# Altium project Main_circuit.PrjPcb
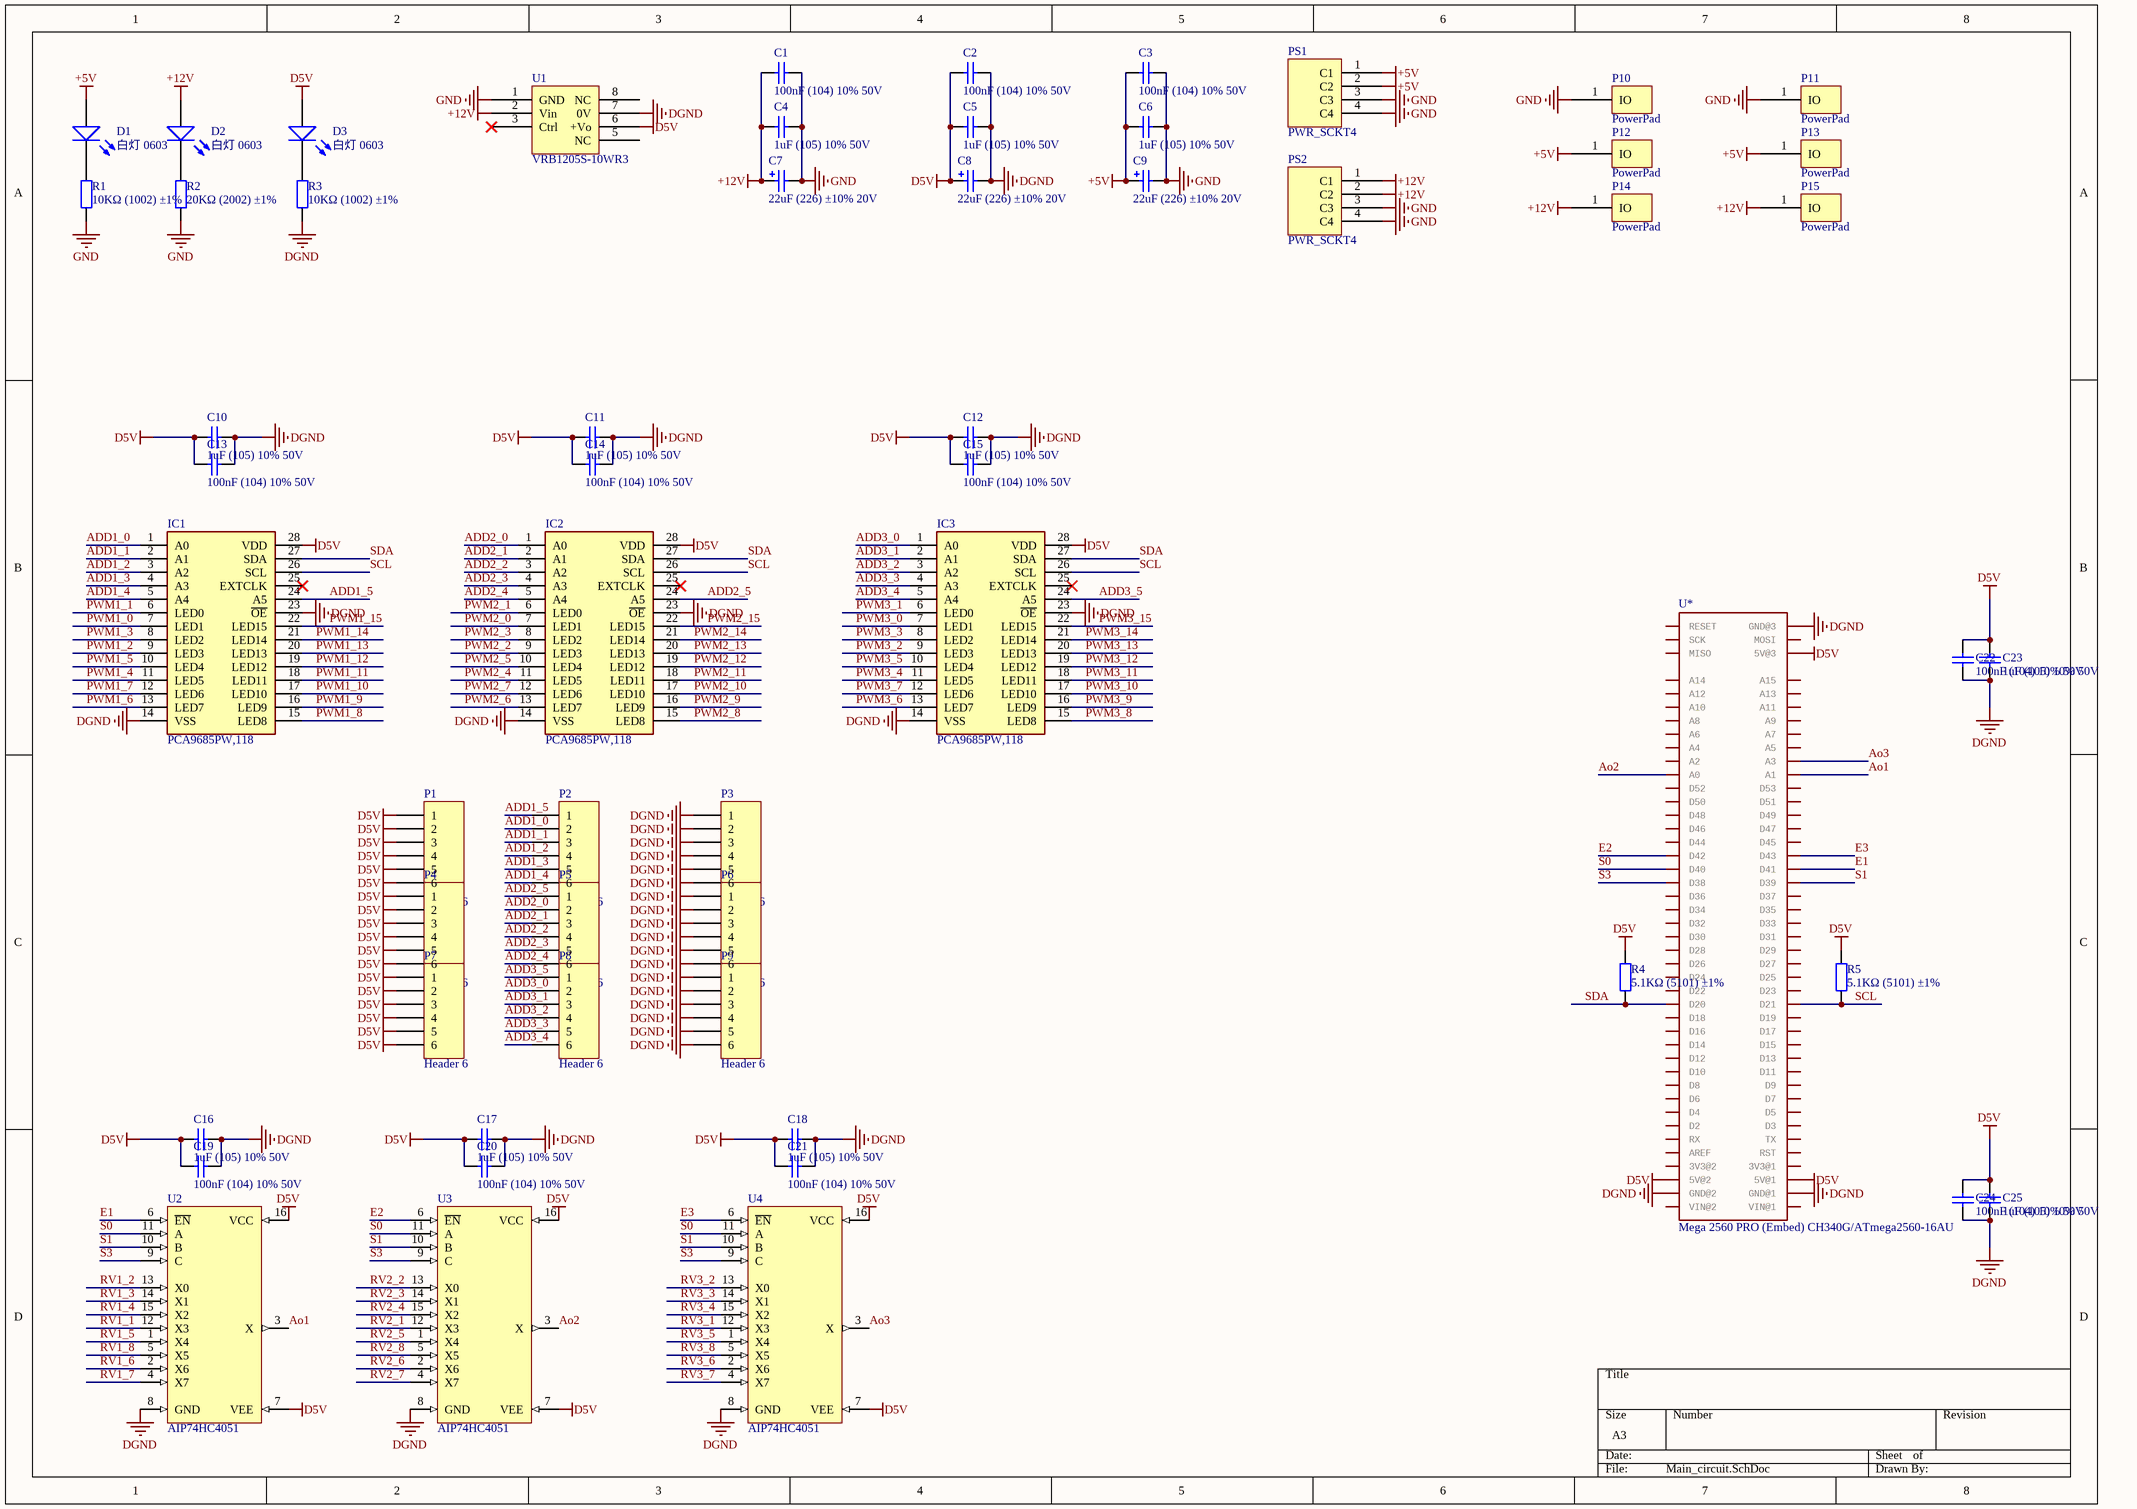
[diagram p0: Main_circuit.SchDoc]
2 sheets, 82 parts. Net scope: global (net labels, ports and power ports of the same name join across sheets).
Board file: MainCircuit.PcbDoc
Sheets:
  Main_circuit.SchDoc
  SS_24.SchDoc

## Sheet Main_circuit.SchDoc
size A3

### Parts
C1  100nF (104) 10% 50V  [LC-0603_C]
C2  100nF (104) 10% 50V  [LC-0603_C]
C3  100nF (104) 10% 50V  [LC-0603_C]
C4  1uF (105) 10% 50V  [LC-0603_C]
C5  1uF (105) 10% 50V  [LC-0603_C]
C6  1uF (105) 10% 50V  [LC-0603_C]
C7  22uF (226) ±10% 20V  [LC-CASE-B_3528]
C8  22uF (226) ±10% 20V  [LC-CASE-B_3528]
C9  22uF (226) ±10% 20V  [LC-CASE-B_3528]
C10  1uF (105) 10% 50V  [LC-0603_C]
C11  1uF (105) 10% 50V  [LC-0603_C]
C12  1uF (105) 10% 50V  [LC-0603_C]
C13  100nF (104) 10% 50V  [LC-0603_C]
C14  100nF (104) 10% 50V  [LC-0603_C]
C15  100nF (104) 10% 50V  [LC-0603_C]
C16  1uF (105) 10% 50V  [LC-0603_C]
C17  1uF (105) 10% 50V  [LC-0603_C]
C18  1uF (105) 10% 50V  [LC-0603_C]
C19  100nF (104) 10% 50V  [LC-0603_C]
C20  100nF (104) 10% 50V  [LC-0603_C]
C21  100nF (104) 10% 50V  [LC-0603_C]
C22  100nF (104) 10% 50V  [LC-0603_C]
C23  1uF (105) 10% 50V  [LC-0603_C]
C24  100nF (104) 10% 50V  [LC-0603_C]
C25  1uF (105) 10% 50V  [LC-0603_C]
D1  白灯 0603  [LC-0603_LED_S1]
D2  白灯 0603  [LC-0603_LED_S1]
D3  白灯 0603  [LC-0603_LED_S1]
IC1  PCA9685PW,118  [LC-TSSOP-28]
IC2  PCA9685PW,118  [LC-TSSOP-28]
IC3  PCA9685PW,118  [LC-TSSOP-28]
P1  Header 6  [HDR1X6]
P2  Header 6  [HDR1X6]
P3  Header 6  [HDR1X6]
P4  Header 6  [HDR1X6]
P5  Header 6  [HDR1X6]
P6  Header 6  [HDR1X6]
P7  Header 6  [HDR1X6]
P8  Header 6  [HDR1X6]
P9  Header 6  [HDR1X6]
P10  PowerPad  [PowerPad]
P11  PowerPad  [PowerPad]
P12  PowerPad  [PowerPad]
P13  PowerPad  [PowerPad]
P14  PowerPad  [PowerPad]
P15  PowerPad  [PowerPad]
PS1  PWR_SCKT4  [PWR_SCKT_4P3.81]
PS2  PWR_SCKT4  [PWR_SCKT_4P3.81]
R1  10KΩ (1002) ±1%  [LC-0603_R]
R2  20KΩ (2002) ±1%  [LC-0603_R]
R3  10KΩ (1002) ±1%  [LC-0603_R]
R4  5.1KΩ (5101) ±1%  [LC-0603_R]
R5  5.1KΩ (5101) ±1%  [LC-0603_R]
U1  VRB1205S-10WR3  [VRB1205S-10WR3]
U2  AIP74HC4051  [LC-SOP-16_150mil]
U3  AIP74HC4051  [LC-SOP-16_150mil]
U4  AIP74HC4051  [LC-SOP-16_150mil]
U*  Mega 2560 PRO (Embed) CH340G/ATmega2560-16AU  [Mega 2560 PRO (Embed)]

### Nets
+5V: C3.2 C6.2 C9.1 D1.A P12.1(IO) P13.1(IO) PS1.1(C1) PS1.2(C2)
+12V: C1.2 C4.2 C7.1 D2.A P14.1(IO) P15.1(IO) PS2.1(C1) PS2.2(C2) U1.2(Vin)
D5V: C2.2 C5.2 C8.1 C10.1 C11.1 C12.1 C13.1 C14.1 C15.1 C16.1 C17.1 C18.1 C19.1 C20.1 C21.1 C22.1 C23.1 C24.1 C25.1 D3.A IC1.28(VDD) IC2.28(VDD) IC3.28(VDD) P1.1 P1.2 P1.3 P1.4 P1.5 P1.6 P4.1 P4.2 P4.3 P4.4 P4.5 P4.6 P7.1 P7.2 P7.3 P7.4 P7.5 P7.6 R4.2 R5.2 U1.6(+Vo) U2.7(VEE) U2.16(VCC) U3.7(VEE) U3.16(VCC) U4.7(VEE) U4.16(VCC) U*.5V@1 U*.5V@2 U*.5V@3
DGND: C2.1 C5.1 C8.2 C10.2 C11.2 C12.2 C13.2 C14.2 C15.2 C16.2 C17.2 C18.2 C19.2 C20.2 C21.2 C22.2 C23.2 C24.2 C25.2 IC1.14(VSS) IC1.23(~{OE}) IC2.14(VSS) IC2.23(~{OE}) IC3.14(VSS) IC3.23(~{OE}) P3.1 P3.2 P3.3 P3.4 P3.5 P3.6 P6.1 P6.2 P6.3 P6.4 P6.5 P6.6 P9.1 P9.2 P9.3 P9.4 P9.5 P9.6 R3.1 U1.7(0V) U2.8(GND) U3.8(GND) U4.8(GND) U*.GND@1 U*.GND@2 U*.GND@3
GND: C1.1 C3.1 C4.1 C6.1 C7.2 C9.2 P10.1(IO) P11.1(IO) PS1.3(C3) PS1.4(C4) PS2.3(C3) PS2.4(C4) R1.1 R2.1 U1.1(GND)
ADD1_0: IC1.1(A0) P2.2
ADD1_1: IC1.2(A1) P2.3
ADD1_2: IC1.3(A2) P2.4
ADD1_3: IC1.4(A3) P2.5
ADD1_4: IC1.5(A4) P2.6
ADD1_5: IC1.24(A5) P2.1
ADD2_0: IC2.1(A0) P5.2
ADD2_1: IC2.2(A1) P5.3
ADD2_2: IC2.3(A2) P5.4
ADD2_3: IC2.4(A3) P5.5
ADD2_4: IC2.5(A4) P5.6
ADD2_5: IC2.24(A5) P5.1
ADD3_0: IC3.1(A0) P8.2
ADD3_1: IC3.2(A1) P8.3
ADD3_2: IC3.3(A2) P8.4
ADD3_3: IC3.4(A3) P8.5
ADD3_4: IC3.5(A4) P8.6
ADD3_5: IC3.24(A5) P8.1
Ao1: U2.3(X) U*.A1
Ao2: U3.3(X) U*.A0
Ao3: U4.3(X) U*.A3
E1: U2.6(~{EN}) U*.D41
E2: U3.6(~{EN}) U*.D42
E3: U4.6(~{EN}) U*.D43
PWM1_0: IC1.7(LED1)
PWM1_1: IC1.6(LED0)
PWM1_2: IC1.9(LED3)
PWM1_3: IC1.8(LED2)
PWM1_4: IC1.11(LED5)
PWM1_5: IC1.10(LED4)
PWM1_6: IC1.13(LED7)
PWM1_7: IC1.12(LED6)
PWM1_8: IC1.15(LED8)
PWM1_9: IC1.16(LED9)
PWM1_10: IC1.17(LED10)
PWM1_11: IC1.18(LED11)
PWM1_12: IC1.19(LED12)
PWM1_13: IC1.20(LED13)
PWM1_14: IC1.21(LED14)
PWM1_15: IC1.22(LED15)
PWM2_0: IC2.7(LED1)
PWM2_1: IC2.6(LED0)
PWM2_2: IC2.9(LED3)
PWM2_3: IC2.8(LED2)
PWM2_4: IC2.11(LED5)
PWM2_5: IC2.10(LED4)
PWM2_6: IC2.13(LED7)
PWM2_7: IC2.12(LED6)
PWM2_8: IC2.15(LED8)
PWM2_9: IC2.16(LED9)
PWM2_10: IC2.17(LED10)
PWM2_11: IC2.18(LED11)
PWM2_12: IC2.19(LED12)
PWM2_13: IC2.20(LED13)
PWM2_14: IC2.21(LED14)
PWM2_15: IC2.22(LED15)
PWM3_0: IC3.7(LED1)
PWM3_1: IC3.6(LED0)
PWM3_2: IC3.9(LED3)
PWM3_3: IC3.8(LED2)
PWM3_4: IC3.11(LED5)
PWM3_5: IC3.10(LED4)
PWM3_6: IC3.13(LED7)
PWM3_7: IC3.12(LED6)
PWM3_8: IC3.15(LED8)
PWM3_9: IC3.16(LED9)
PWM3_10: IC3.17(LED10)
PWM3_11: IC3.18(LED11)
PWM3_12: IC3.19(LED12)
PWM3_13: IC3.20(LED13)
PWM3_14: IC3.21(LED14)
PWM3_15: IC3.22(LED15)
RV1_1: U2.12(X3)
RV1_2: U2.13(X0)
RV1_3: U2.14(X1)
RV1_4: U2.15(X2)
RV1_5: U2.1(X4)
RV1_6: U2.2(X6)
RV1_7: U2.4(X7)
RV1_8: U2.5(X5)
RV2_1: U3.12(X3)
RV2_2: U3.13(X0)
RV2_3: U3.14(X1)
RV2_4: U3.15(X2)
RV2_5: U3.1(X4)
RV2_6: U3.2(X6)
RV2_7: U3.4(X7)
RV2_8: U3.5(X5)
RV3_1: U4.12(X3)
RV3_2: U4.13(X0)
RV3_3: U4.14(X1)
RV3_4: U4.15(X2)
RV3_5: U4.1(X4)
RV3_6: U4.2(X6)
RV3_7: U4.4(X7)
RV3_8: U4.5(X5)
S0: U2.11(A) U3.11(A) U4.11(A) U*.D40
S1: U2.10(B) U3.10(B) U4.10(B) U*.D39
S3: U2.9(C) U3.9(C) U4.9(C) U*.D38
SCL: IC1.26(SCL) IC2.26(SCL) IC3.26(SCL) R5.1 U*.D21
SDA: IC1.27(SDA) IC2.27(SDA) IC3.27(SDA) R4.1 U*.D20
NetD1_K: D1.K R1.2
NetD2_K: D2.K R2.2
NetD3_K: D3.K R3.2

Not connected (* = marked no-connect by the designer): IC1 25(EXTCLK)*; IC2 25(EXTCLK)*; IC3 25(EXTCLK)*; U1 3(Ctrl)* 5(NC) 8(NC); U* 3V3@1 3V3@2 A2 A4 A5 A6 A7 A8 A9 A10 A11 A12 A13 A14 A15 AREF D2 D3 D4 D5 D6 D7 D8 D9 D10 D11 D12 D13 D14 D15 D16 D17 D18 D19 D22 D23 D24 D25 D26 D27 D28 D29 D30 D31 D32 D33 D34 D35 D36 D37 D44 D45 D46 D47 D48 D49 D50 D51 D52 D53 MISO MOSI RESET RST RX SCK TX VIN@1 VIN@2

### Library data of the parts
C1-C3 C13-C15 C19-C22 C24 = 0603 100nF (104) 10% 50V: 贴片电容; ComponentLink1Description: 供应商链接; ComponentLink1URL: http://www.szlcsc.com/product/details_15331.html; Package: 0603; Supplier: LC; SuppliersPartNumber: C14663
C4-C6 C10-C12 C16-C18 C23 C25 = 0603 1uF (105) 10% 50V: 贴片电容; ComponentLink1Description: 供应商链接; ComponentLink1URL: http://www.szlcsc.com/product/details_16531.html; Package: 0603; Supplier: LC; SuppliersPartNumber: C15849
C7-C9 = 3216 10uF (106) 10% 16V: 钽电容; ComponentLink1Description: 供应商链接; ComponentLink1URL: http://www.szlcsc.com/product/details_7643.html; Package: 3528; Supplier: LC; SuppliersPartNumber: C122277
D1-D3 = 0603 白灯: 发光二极管; ComponentLink1Description: 供应商链接; ComponentLink1URL: http://www.szlcsc.com/product/details_2663.html; Package: 0603; Supplier: LC; SuppliersPartNumber: C2290
IC1-IC3 = PCA9685PW,118: Integrated Circuit; Manufacturer_Name: NXP; Datasheet Link: http://www.nxp.com/docs/en/data-sheet/PCA9685.pdf; Height: 1.1mm; SuppliersPartNumber: C92206; Package: TSSOP-28; Manufacturer_Part_Number: PCA9685PW,118
P1-P9 = Header 6: Header, 6-Pin; LatestRevisionDate: 17-Jul-2002; LatestRevisionNote: Re-released for DXP Platform.; Publisher: Altium Limited
PS1 PS2 = POWER_SOCKET4: POWER SOCKET
R1 R3 = 0603 10KΩ (1002) 1%: 贴片电阻; ComponentLink1Description: 供应商链接; ComponentLink1URL: http://www.szlcsc.com/product/details_26547.html; Package: 0603; Supplier: LC; SuppliersPartNumber: C25804
R2 = 0603 20KΩ (2002) 1%: 贴片电阻; ComponentLink1Description: 供应商链接; ComponentLink1URL: http://www.szlcsc.com/product/details_4591.html; Package: 0603; Supplier: LC; SuppliersPartNumber: C4184
R4 R5 = 0603 5.1KΩ (5101) 1%: 贴片电阻; ComponentLink1Description: 供应商链接; ComponentLink1URL: http://www.szlcsc.com/product/details_23913.html; Package: 0603; Supplier: LC; SuppliersPartNumber: C23186
U1 = VRB1205S-10WR3: Packge: Through Hole; SuppliersPartNumber: C970789
U2-U4 = CD4051BM96: 4000系列逻辑芯片; ComponentLink1Description: 供应商链接; ComponentLink1URL: http://www.szlcsc.com/product/details_22096.html; Package: SOP-16_150mil; Supplier: LC; SuppliersPartNumber: C93010
U* = Mega 2560 PRO (Embed): The Mega Pro Embed CH340G / ATmega2560 board is based on the ATmega2560 microcontroller and the USB-UART adapter CH340. The board is compatible with Arduino Mega 2560.

## Sheet SS_24.SchDoc
size A2
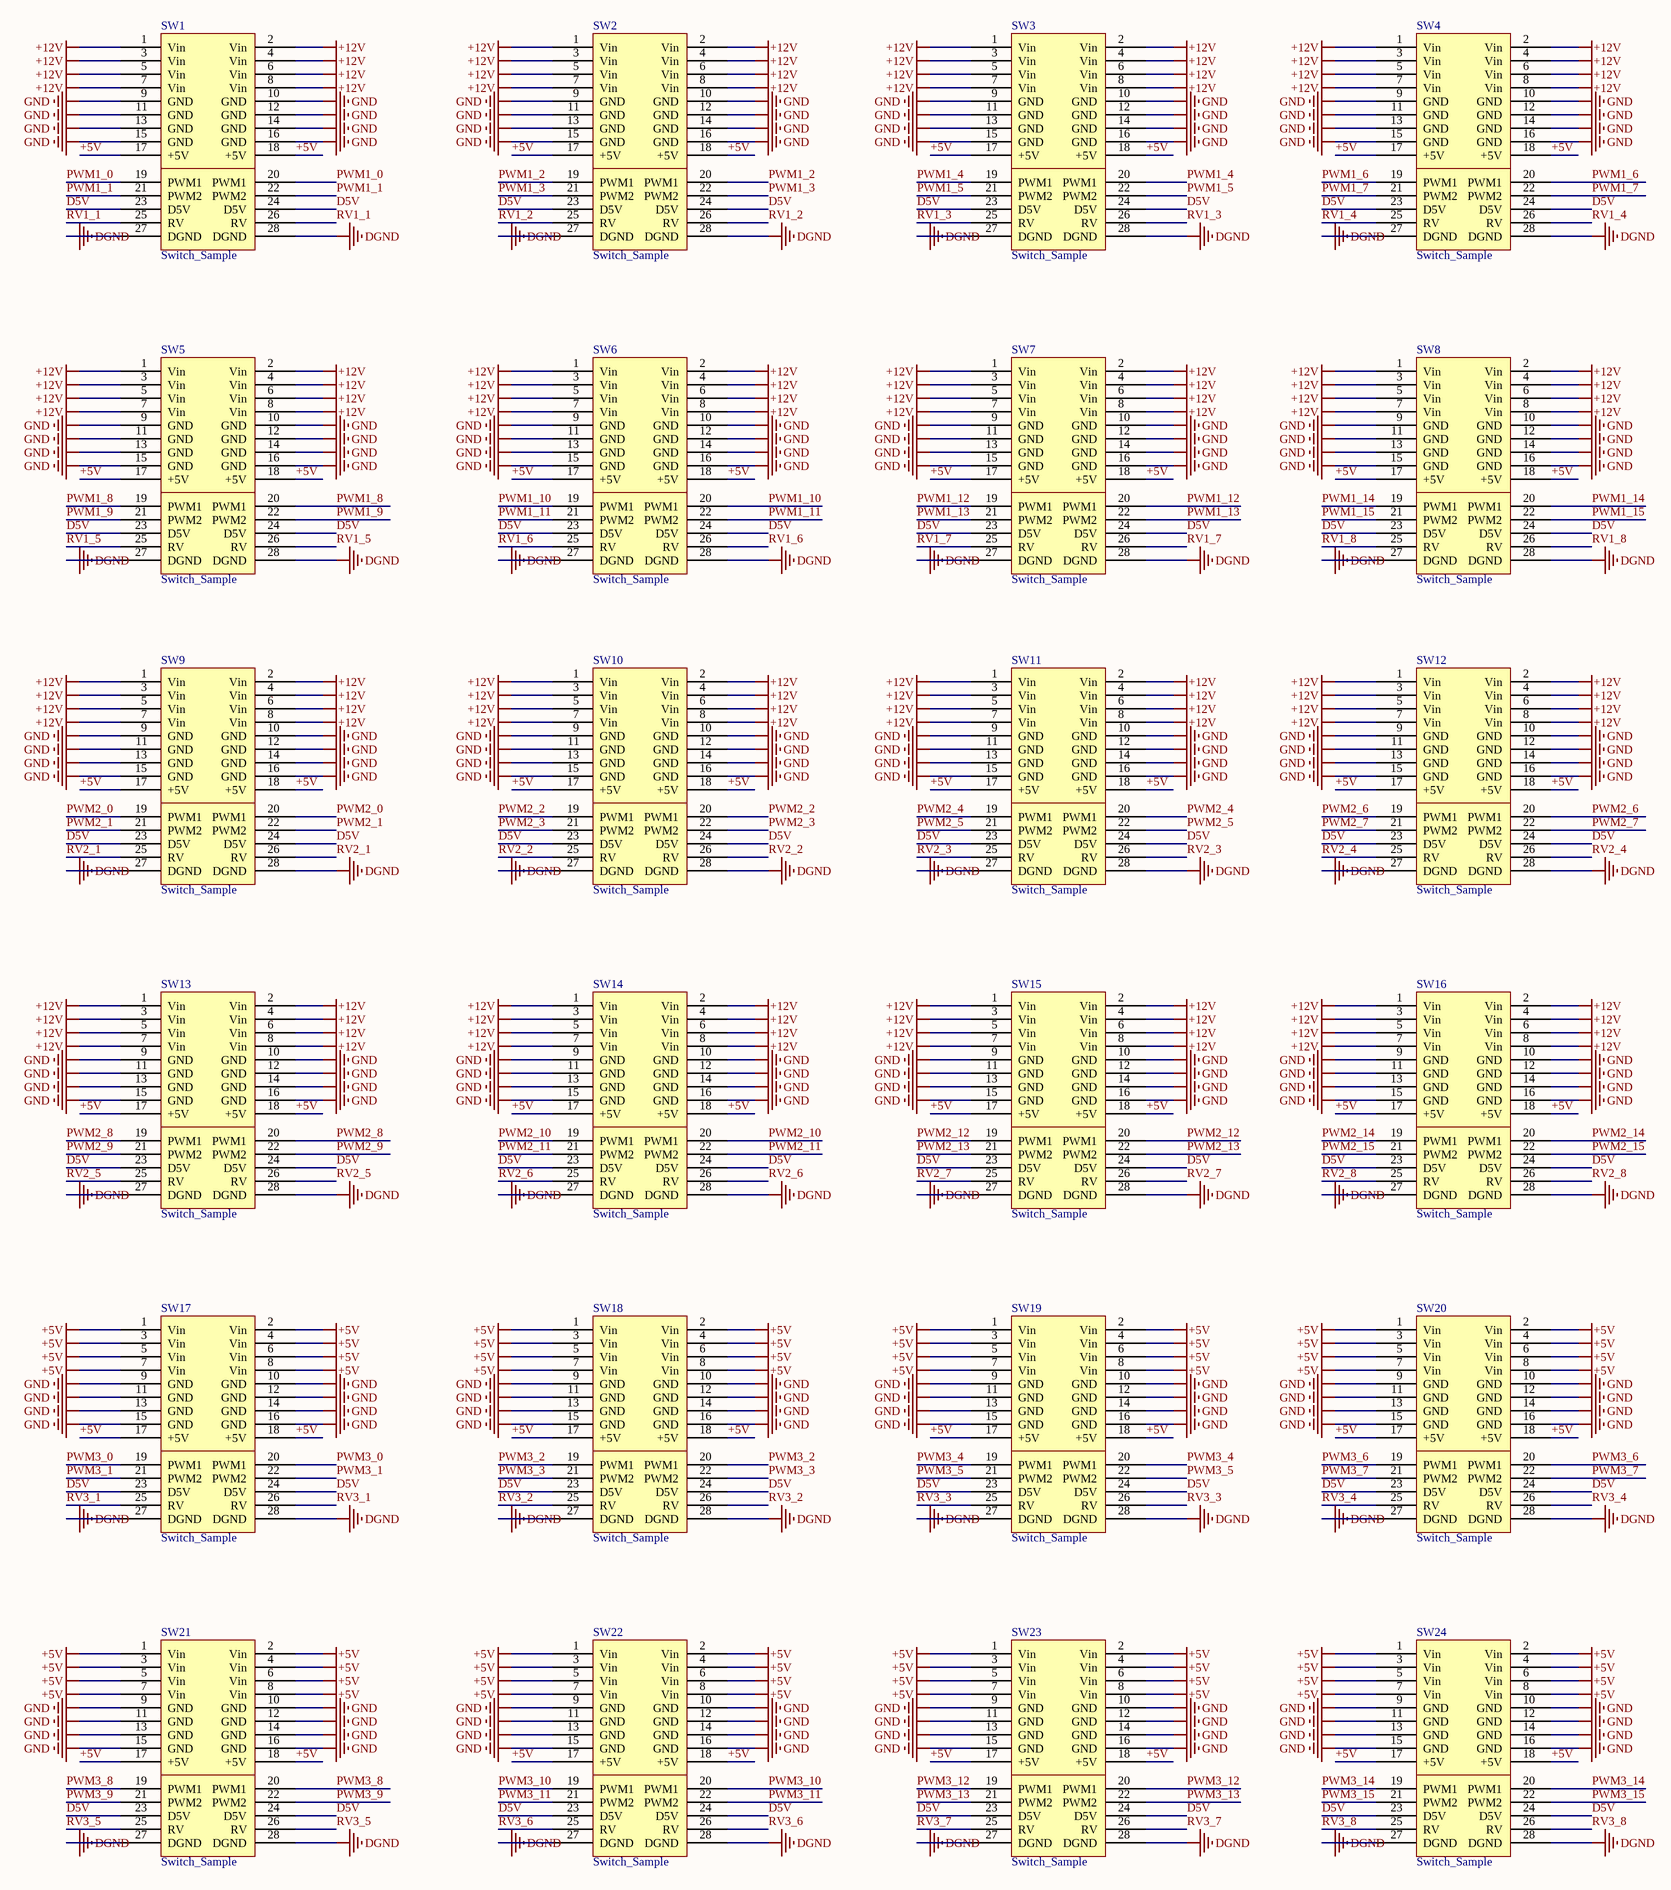
[diagram p1: SS_24.SchDoc]

### Parts
SW1  Switch_Sample  [Switch_Sample]
SW2  Switch_Sample  [Switch_Sample]
SW3  Switch_Sample  [Switch_Sample]
SW4  Switch_Sample  [Switch_Sample]
SW5  Switch_Sample  [Switch_Sample]
SW6  Switch_Sample  [Switch_Sample]
SW7  Switch_Sample  [Switch_Sample]
SW8  Switch_Sample  [Switch_Sample]
SW9  Switch_Sample  [Switch_Sample]
SW10  Switch_Sample  [Switch_Sample]
SW11  Switch_Sample  [Switch_Sample]
SW12  Switch_Sample  [Switch_Sample]
SW13  Switch_Sample  [Switch_Sample]
SW14  Switch_Sample  [Switch_Sample]
SW15  Switch_Sample  [Switch_Sample]
SW16  Switch_Sample  [Switch_Sample]
SW17  Switch_Sample  [Switch_Sample]
SW18  Switch_Sample  [Switch_Sample]
SW19  Switch_Sample  [Switch_Sample]
SW20  Switch_Sample  [Switch_Sample]
SW21  Switch_Sample  [Switch_Sample]
SW22  Switch_Sample  [Switch_Sample]
SW23  Switch_Sample  [Switch_Sample]
SW24  Switch_Sample  [Switch_Sample]

### Nets
+5V: SW1.17(+5V) SW1.18(+5V) SW2.17(+5V) SW2.18(+5V) SW3.17(+5V) SW3.18(+5V) SW4.17(+5V) SW4.18(+5V) SW5.17(+5V) SW5.18(+5V) SW6.17(+5V) SW6.18(+5V) SW7.17(+5V) SW7.18(+5V) SW8.17(+5V) SW8.18(+5V) SW9.17(+5V) SW9.18(+5V) SW10.17(+5V) SW10.18(+5V) SW11.17(+5V) SW11.18(+5V) SW12.17(+5V) SW12.18(+5V) SW13.17(+5V) SW13.18(+5V) SW14.17(+5V) SW14.18(+5V) SW15.17(+5V) SW15.18(+5V) SW16.17(+5V) SW16.18(+5V) SW17.1(Vin) SW17.2(Vin) SW17.3(Vin) SW17.4(Vin) SW17.5(Vin) SW17.6(Vin) SW17.7(Vin) SW17.8(Vin) SW17.17(+5V) SW17.18(+5V) SW18.1(Vin) SW18.2(Vin) SW18.3(Vin) SW18.4(Vin) SW18.5(Vin) SW18.6(Vin) SW18.7(Vin) SW18.8(Vin) SW18.17(+5V) SW18.18(+5V) SW19.1(Vin) SW19.2(Vin) SW19.3(Vin) SW19.4(Vin) SW19.5(Vin) SW19.6(Vin) SW19.7(Vin) SW19.8(Vin) SW19.17(+5V) SW19.18(+5V) SW20.1(Vin) SW20.2(Vin) SW20.3(Vin) SW20.4(Vin) SW20.5(Vin) SW20.6(Vin) SW20.7(Vin) SW20.8(Vin) SW20.17(+5V) SW20.18(+5V) SW21.1(Vin) SW21.2(Vin) SW21.3(Vin) SW21.4(Vin) SW21.5(Vin) SW21.6(Vin) SW21.7(Vin) SW21.8(Vin) SW21.17(+5V) SW21.18(+5V) SW22.1(Vin) SW22.2(Vin) SW22.3(Vin) SW22.4(Vin) SW22.5(Vin) SW22.6(Vin) SW22.7(Vin) SW22.8(Vin) SW22.17(+5V) SW22.18(+5V) SW23.1(Vin) SW23.2(Vin) SW23.3(Vin) SW23.4(Vin) SW23.5(Vin) SW23.6(Vin) SW23.7(Vin) SW23.8(Vin) SW23.17(+5V) SW23.18(+5V) SW24.1(Vin) SW24.2(Vin) SW24.3(Vin) SW24.4(Vin) SW24.5(Vin) SW24.6(Vin) SW24.7(Vin) SW24.8(Vin) SW24.17(+5V) SW24.18(+5V)
+12V: SW1.1(Vin) SW1.2(Vin) SW1.3(Vin) SW1.4(Vin) SW1.5(Vin) SW1.6(Vin) SW1.7(Vin) SW1.8(Vin) SW2.1(Vin) SW2.2(Vin) SW2.3(Vin) SW2.4(Vin) SW2.5(Vin) SW2.6(Vin) SW2.7(Vin) SW2.8(Vin) SW3.1(Vin) SW3.2(Vin) SW3.3(Vin) SW3.4(Vin) SW3.5(Vin) SW3.6(Vin) SW3.7(Vin) SW3.8(Vin) SW4.1(Vin) SW4.2(Vin) SW4.3(Vin) SW4.4(Vin) SW4.5(Vin) SW4.6(Vin) SW4.7(Vin) SW4.8(Vin) SW5.1(Vin) SW5.2(Vin) SW5.3(Vin) SW5.4(Vin) SW5.5(Vin) SW5.6(Vin) SW5.7(Vin) SW5.8(Vin) SW6.1(Vin) SW6.2(Vin) SW6.3(Vin) SW6.4(Vin) SW6.5(Vin) SW6.6(Vin) SW6.7(Vin) SW6.8(Vin) SW7.1(Vin) SW7.2(Vin) SW7.3(Vin) SW7.4(Vin) SW7.5(Vin) SW7.6(Vin) SW7.7(Vin) SW7.8(Vin) SW8.1(Vin) SW8.2(Vin) SW8.3(Vin) SW8.4(Vin) SW8.5(Vin) SW8.6(Vin) SW8.7(Vin) SW8.8(Vin) SW9.1(Vin) SW9.2(Vin) SW9.3(Vin) SW9.4(Vin) SW9.5(Vin) SW9.6(Vin) SW9.7(Vin) SW9.8(Vin) SW10.1(Vin) SW10.2(Vin) SW10.3(Vin) SW10.4(Vin) SW10.5(Vin) SW10.6(Vin) SW10.7(Vin) SW10.8(Vin) SW11.1(Vin) SW11.2(Vin) SW11.3(Vin) SW11.4(Vin) SW11.5(Vin) SW11.6(Vin) SW11.7(Vin) SW11.8(Vin) SW12.1(Vin) SW12.2(Vin) SW12.3(Vin) SW12.4(Vin) SW12.5(Vin) SW12.6(Vin) SW12.7(Vin) SW12.8(Vin) SW13.1(Vin) SW13.2(Vin) SW13.3(Vin) SW13.4(Vin) SW13.5(Vin) SW13.6(Vin) SW13.7(Vin) SW13.8(Vin) SW14.1(Vin) SW14.2(Vin) SW14.3(Vin) SW14.4(Vin) SW14.5(Vin) SW14.6(Vin) SW14.7(Vin) SW14.8(Vin) SW15.1(Vin) SW15.2(Vin) SW15.3(Vin) SW15.4(Vin) SW15.5(Vin) SW15.6(Vin) SW15.7(Vin) SW15.8(Vin) SW16.1(Vin) SW16.2(Vin) SW16.3(Vin) SW16.4(Vin) SW16.5(Vin) SW16.6(Vin) SW16.7(Vin) SW16.8(Vin)
D5V: SW1.23(D5V) SW1.24(D5V) SW2.23(D5V) SW2.24(D5V) SW3.23(D5V) SW3.24(D5V) SW4.23(D5V) SW4.24(D5V) SW5.23(D5V) SW5.24(D5V) SW6.23(D5V) SW6.24(D5V) SW7.23(D5V) SW7.24(D5V) SW8.23(D5V) SW8.24(D5V) SW9.23(D5V) SW9.24(D5V) SW10.23(D5V) SW10.24(D5V) SW11.23(D5V) SW11.24(D5V) SW12.23(D5V) SW12.24(D5V) SW13.23(D5V) SW13.24(D5V) SW14.23(D5V) SW14.24(D5V) SW15.23(D5V) SW15.24(D5V) SW16.23(D5V) SW16.24(D5V) SW17.23(D5V) SW17.24(D5V) SW18.23(D5V) SW18.24(D5V) SW19.23(D5V) SW19.24(D5V) SW20.23(D5V) SW20.24(D5V) SW21.23(D5V) SW21.24(D5V) SW22.23(D5V) SW22.24(D5V) SW23.23(D5V) SW23.24(D5V) SW24.23(D5V) SW24.24(D5V)
DGND: SW1.27(DGND) SW1.28(DGND) SW2.27(DGND) SW2.28(DGND) SW3.27(DGND) SW3.28(DGND) SW4.27(DGND) SW4.28(DGND) SW5.27(DGND) SW5.28(DGND) SW6.27(DGND) SW6.28(DGND) SW7.27(DGND) SW7.28(DGND) SW8.27(DGND) SW8.28(DGND) SW9.27(DGND) SW9.28(DGND) SW10.27(DGND) SW10.28(DGND) SW11.27(DGND) SW11.28(DGND) SW12.27(DGND) SW12.28(DGND) SW13.27(DGND) SW13.28(DGND) SW14.27(DGND) SW14.28(DGND) SW15.27(DGND) SW15.28(DGND) SW16.27(DGND) SW16.28(DGND) SW17.27(DGND) SW17.28(DGND) SW18.27(DGND) SW18.28(DGND) SW19.27(DGND) SW19.28(DGND) SW20.27(DGND) SW20.28(DGND) SW21.27(DGND) SW21.28(DGND) SW22.27(DGND) SW22.28(DGND) SW23.27(DGND) SW23.28(DGND) SW24.27(DGND) SW24.28(DGND)
GND: SW1.9(GND) SW1.10(GND) SW1.11(GND) SW1.12(GND) SW1.13(GND) SW1.14(GND) SW1.15(GND) SW1.16(GND) SW2.9(GND) SW2.10(GND) SW2.11(GND) SW2.12(GND) SW2.13(GND) SW2.14(GND) SW2.15(GND) SW2.16(GND) SW3.9(GND) SW3.10(GND) SW3.11(GND) SW3.12(GND) SW3.13(GND) SW3.14(GND) SW3.15(GND) SW3.16(GND) SW4.9(GND) SW4.10(GND) SW4.11(GND) SW4.12(GND) SW4.13(GND) SW4.14(GND) SW4.15(GND) SW4.16(GND) SW5.9(GND) SW5.10(GND) SW5.11(GND) SW5.12(GND) SW5.13(GND) SW5.14(GND) SW5.15(GND) SW5.16(GND) SW6.9(GND) SW6.10(GND) SW6.11(GND) SW6.12(GND) SW6.13(GND) SW6.14(GND) SW6.15(GND) SW6.16(GND) SW7.9(GND) SW7.10(GND) SW7.11(GND) SW7.12(GND) SW7.13(GND) SW7.14(GND) SW7.15(GND) SW7.16(GND) SW8.9(GND) SW8.10(GND) SW8.11(GND) SW8.12(GND) SW8.13(GND) SW8.14(GND) SW8.15(GND) SW8.16(GND) SW9.9(GND) SW9.10(GND) SW9.11(GND) SW9.12(GND) SW9.13(GND) SW9.14(GND) SW9.15(GND) SW9.16(GND) SW10.9(GND) SW10.10(GND) SW10.11(GND) SW10.12(GND) SW10.13(GND) SW10.14(GND) SW10.15(GND) SW10.16(GND) SW11.9(GND) SW11.10(GND) SW11.11(GND) SW11.12(GND) SW11.13(GND) SW11.14(GND) SW11.15(GND) SW11.16(GND) SW12.9(GND) SW12.10(GND) SW12.11(GND) SW12.12(GND) SW12.13(GND) SW12.14(GND) SW12.15(GND) SW12.16(GND) SW13.9(GND) SW13.10(GND) SW13.11(GND) SW13.12(GND) SW13.13(GND) SW13.14(GND) SW13.15(GND) SW13.16(GND) SW14.9(GND) SW14.10(GND) SW14.11(GND) SW14.12(GND) SW14.13(GND) SW14.14(GND) SW14.15(GND) SW14.16(GND) SW15.9(GND) SW15.10(GND) SW15.11(GND) SW15.12(GND) SW15.13(GND) SW15.14(GND) SW15.15(GND) SW15.16(GND) SW16.9(GND) SW16.10(GND) SW16.11(GND) SW16.12(GND) SW16.13(GND) SW16.14(GND) SW16.15(GND) SW16.16(GND) SW17.9(GND) SW17.10(GND) SW17.11(GND) SW17.12(GND) SW17.13(GND) SW17.14(GND) SW17.15(GND) SW17.16(GND) SW18.9(GND) SW18.10(GND) SW18.11(GND) SW18.12(GND) SW18.13(GND) SW18.14(GND) SW18.15(GND) SW18.16(GND) SW19.9(GND) SW19.10(GND) SW19.11(GND) SW19.12(GND) SW19.13(GND) SW19.14(GND) SW19.15(GND) SW19.16(GND) SW20.9(GND) SW20.10(GND) SW20.11(GND) SW20.12(GND) SW20.13(GND) SW20.14(GND) SW20.15(GND) SW20.16(GND) SW21.9(GND) SW21.10(GND) SW21.11(GND) SW21.12(GND) SW21.13(GND) SW21.14(GND) SW21.15(GND) SW21.16(GND) SW22.9(GND) SW22.10(GND) SW22.11(GND) SW22.12(GND) SW22.13(GND) SW22.14(GND) SW22.15(GND) SW22.16(GND) SW23.9(GND) SW23.10(GND) SW23.11(GND) SW23.12(GND) SW23.13(GND) SW23.14(GND) SW23.15(GND) SW23.16(GND) SW24.9(GND) SW24.10(GND) SW24.11(GND) SW24.12(GND) SW24.13(GND) SW24.14(GND) SW24.15(GND) SW24.16(GND)
PWM1_0: SW1.19(PWM1) SW1.20(PWM1)
PWM1_1: SW1.21(PWM2) SW1.22(PWM2)
PWM1_2: SW2.19(PWM1) SW2.20(PWM1)
PWM1_3: SW2.21(PWM2) SW2.22(PWM2)
PWM1_4: SW3.19(PWM1) SW3.20(PWM1)
PWM1_5: SW3.21(PWM2) SW3.22(PWM2)
PWM1_6: SW4.19(PWM1) SW4.20(PWM1)
PWM1_7: SW4.21(PWM2) SW4.22(PWM2)
PWM1_8: SW5.19(PWM1) SW5.20(PWM1)
PWM1_9: SW5.21(PWM2) SW5.22(PWM2)
PWM1_10: SW6.19(PWM1) SW6.20(PWM1)
PWM1_11: SW6.21(PWM2) SW6.22(PWM2)
PWM1_12: SW7.19(PWM1) SW7.20(PWM1)
PWM1_13: SW7.21(PWM2) SW7.22(PWM2)
PWM1_14: SW8.19(PWM1) SW8.20(PWM1)
PWM1_15: SW8.21(PWM2) SW8.22(PWM2)
PWM2_0: SW9.19(PWM1) SW9.20(PWM1)
PWM2_1: SW9.21(PWM2) SW9.22(PWM2)
PWM2_2: SW10.19(PWM1) SW10.20(PWM1)
PWM2_3: SW10.21(PWM2) SW10.22(PWM2)
PWM2_4: SW11.19(PWM1) SW11.20(PWM1)
PWM2_5: SW11.21(PWM2) SW11.22(PWM2)
PWM2_6: SW12.19(PWM1) SW12.20(PWM1)
PWM2_7: SW12.21(PWM2) SW12.22(PWM2)
PWM2_8: SW13.19(PWM1) SW13.20(PWM1)
PWM2_9: SW13.21(PWM2) SW13.22(PWM2)
PWM2_10: SW14.19(PWM1) SW14.20(PWM1)
PWM2_11: SW14.21(PWM2) SW14.22(PWM2)
PWM2_12: SW15.19(PWM1) SW15.20(PWM1)
PWM2_13: SW15.21(PWM2) SW15.22(PWM2)
PWM2_14: SW16.19(PWM1) SW16.20(PWM1)
PWM2_15: SW16.21(PWM2) SW16.22(PWM2)
PWM3_0: SW17.19(PWM1) SW17.20(PWM1)
PWM3_1: SW17.21(PWM2) SW17.22(PWM2)
PWM3_2: SW18.19(PWM1) SW18.20(PWM1)
PWM3_3: SW18.21(PWM2) SW18.22(PWM2)
PWM3_4: SW19.19(PWM1) SW19.20(PWM1)
PWM3_5: SW19.21(PWM2) SW19.22(PWM2)
PWM3_6: SW20.19(PWM1) SW20.20(PWM1)
PWM3_7: SW20.21(PWM2) SW20.22(PWM2)
PWM3_8: SW21.19(PWM1) SW21.20(PWM1)
PWM3_9: SW21.21(PWM2) SW21.22(PWM2)
PWM3_10: SW22.19(PWM1) SW22.20(PWM1)
PWM3_11: SW22.21(PWM2) SW22.22(PWM2)
PWM3_12: SW23.19(PWM1) SW23.20(PWM1)
PWM3_13: SW23.21(PWM2) SW23.22(PWM2)
PWM3_14: SW24.19(PWM1) SW24.20(PWM1)
PWM3_15: SW24.21(PWM2) SW24.22(PWM2)
RV1_1: SW1.25(RV) SW1.26(RV)
RV1_2: SW2.25(RV) SW2.26(RV)
RV1_3: SW3.25(RV) SW3.26(RV)
RV1_4: SW4.25(RV) SW4.26(RV)
RV1_5: SW5.25(RV) SW5.26(RV)
RV1_6: SW6.25(RV) SW6.26(RV)
RV1_7: SW7.25(RV) SW7.26(RV)
RV1_8: SW8.25(RV) SW8.26(RV)
RV2_1: SW9.25(RV) SW9.26(RV)
RV2_2: SW10.25(RV) SW10.26(RV)
RV2_3: SW11.25(RV) SW11.26(RV)
RV2_4: SW12.25(RV) SW12.26(RV)
RV2_5: SW13.25(RV) SW13.26(RV)
RV2_6: SW14.25(RV) SW14.26(RV)
RV2_7: SW15.25(RV) SW15.26(RV)
RV2_8: SW16.25(RV) SW16.26(RV)
RV3_1: SW17.25(RV) SW17.26(RV)
RV3_2: SW18.25(RV) SW18.26(RV)
RV3_3: SW19.25(RV) SW19.26(RV)
RV3_4: SW20.25(RV) SW20.26(RV)
RV3_5: SW21.25(RV) SW21.26(RV)
RV3_6: SW22.25(RV) SW22.26(RV)
RV3_7: SW23.25(RV) SW23.26(RV)
RV3_8: SW24.25(RV) SW24.26(RV)

## Nets that join several sheets
+5V: Main_circuit (8 pins), SS_24 (112 pins)
+12V: Main_circuit (9 pins), SS_24 (128 pins)
D5V: Main_circuit (53 pins), SS_24 (48 pins)
DGND: Main_circuit (51 pins), SS_24 (48 pins)
GND: Main_circuit (15 pins), SS_24 (192 pins)
PWM1_0: Main_circuit (IC1.7), SS_24 (SW1.19 SW1.20)
PWM1_1: Main_circuit (IC1.6), SS_24 (SW1.21 SW1.22)
PWM1_2: Main_circuit (IC1.9), SS_24 (SW2.19 SW2.20)
PWM1_3: Main_circuit (IC1.8), SS_24 (SW2.21 SW2.22)
PWM1_4: Main_circuit (IC1.11), SS_24 (SW3.19 SW3.20)
PWM1_5: Main_circuit (IC1.10), SS_24 (SW3.21 SW3.22)
PWM1_6: Main_circuit (IC1.13), SS_24 (SW4.19 SW4.20)
PWM1_7: Main_circuit (IC1.12), SS_24 (SW4.21 SW4.22)
PWM1_8: Main_circuit (IC1.15), SS_24 (SW5.19 SW5.20)
PWM1_9: Main_circuit (IC1.16), SS_24 (SW5.21 SW5.22)
PWM1_10: Main_circuit (IC1.17), SS_24 (SW6.19 SW6.20)
PWM1_11: Main_circuit (IC1.18), SS_24 (SW6.21 SW6.22)
PWM1_12: Main_circuit (IC1.19), SS_24 (SW7.19 SW7.20)
PWM1_13: Main_circuit (IC1.20), SS_24 (SW7.21 SW7.22)
PWM1_14: Main_circuit (IC1.21), SS_24 (SW8.19 SW8.20)
PWM1_15: Main_circuit (IC1.22), SS_24 (SW8.21 SW8.22)
PWM2_0: Main_circuit (IC2.7), SS_24 (SW9.19 SW9.20)
PWM2_1: Main_circuit (IC2.6), SS_24 (SW9.21 SW9.22)
PWM2_2: Main_circuit (IC2.9), SS_24 (SW10.19 SW10.20)
PWM2_3: Main_circuit (IC2.8), SS_24 (SW10.21 SW10.22)
PWM2_4: Main_circuit (IC2.11), SS_24 (SW11.19 SW11.20)
PWM2_5: Main_circuit (IC2.10), SS_24 (SW11.21 SW11.22)
PWM2_6: Main_circuit (IC2.13), SS_24 (SW12.19 SW12.20)
PWM2_7: Main_circuit (IC2.12), SS_24 (SW12.21 SW12.22)
PWM2_8: Main_circuit (IC2.15), SS_24 (SW13.19 SW13.20)
PWM2_9: Main_circuit (IC2.16), SS_24 (SW13.21 SW13.22)
PWM2_10: Main_circuit (IC2.17), SS_24 (SW14.19 SW14.20)
PWM2_11: Main_circuit (IC2.18), SS_24 (SW14.21 SW14.22)
PWM2_12: Main_circuit (IC2.19), SS_24 (SW15.19 SW15.20)
PWM2_13: Main_circuit (IC2.20), SS_24 (SW15.21 SW15.22)
PWM2_14: Main_circuit (IC2.21), SS_24 (SW16.19 SW16.20)
PWM2_15: Main_circuit (IC2.22), SS_24 (SW16.21 SW16.22)
PWM3_0: Main_circuit (IC3.7), SS_24 (SW17.19 SW17.20)
PWM3_1: Main_circuit (IC3.6), SS_24 (SW17.21 SW17.22)
PWM3_2: Main_circuit (IC3.9), SS_24 (SW18.19 SW18.20)
PWM3_3: Main_circuit (IC3.8), SS_24 (SW18.21 SW18.22)
PWM3_4: Main_circuit (IC3.11), SS_24 (SW19.19 SW19.20)
PWM3_5: Main_circuit (IC3.10), SS_24 (SW19.21 SW19.22)
PWM3_6: Main_circuit (IC3.13), SS_24 (SW20.19 SW20.20)
PWM3_7: Main_circuit (IC3.12), SS_24 (SW20.21 SW20.22)
PWM3_8: Main_circuit (IC3.15), SS_24 (SW21.19 SW21.20)
PWM3_9: Main_circuit (IC3.16), SS_24 (SW21.21 SW21.22)
PWM3_10: Main_circuit (IC3.17), SS_24 (SW22.19 SW22.20)
PWM3_11: Main_circuit (IC3.18), SS_24 (SW22.21 SW22.22)
PWM3_12: Main_circuit (IC3.19), SS_24 (SW23.19 SW23.20)
PWM3_13: Main_circuit (IC3.20), SS_24 (SW23.21 SW23.22)
PWM3_14: Main_circuit (IC3.21), SS_24 (SW24.19 SW24.20)
PWM3_15: Main_circuit (IC3.22), SS_24 (SW24.21 SW24.22)
RV1_1: Main_circuit (U2.12), SS_24 (SW1.25 SW1.26)
RV1_2: Main_circuit (U2.13), SS_24 (SW2.25 SW2.26)
RV1_3: Main_circuit (U2.14), SS_24 (SW3.25 SW3.26)
RV1_4: Main_circuit (U2.15), SS_24 (SW4.25 SW4.26)
RV1_5: Main_circuit (U2.1), SS_24 (SW5.25 SW5.26)
RV1_6: Main_circuit (U2.2), SS_24 (SW6.25 SW6.26)
RV1_7: Main_circuit (U2.4), SS_24 (SW7.25 SW7.26)
RV1_8: Main_circuit (U2.5), SS_24 (SW8.25 SW8.26)
RV2_1: Main_circuit (U3.12), SS_24 (SW9.25 SW9.26)
RV2_2: Main_circuit (U3.13), SS_24 (SW10.25 SW10.26)
RV2_3: Main_circuit (U3.14), SS_24 (SW11.25 SW11.26)
RV2_4: Main_circuit (U3.15), SS_24 (SW12.25 SW12.26)
RV2_5: Main_circuit (U3.1), SS_24 (SW13.25 SW13.26)
RV2_6: Main_circuit (U3.2), SS_24 (SW14.25 SW14.26)
RV2_7: Main_circuit (U3.4), SS_24 (SW15.25 SW15.26)
RV2_8: Main_circuit (U3.5), SS_24 (SW16.25 SW16.26)
RV3_1: Main_circuit (U4.12), SS_24 (SW17.25 SW17.26)
RV3_2: Main_circuit (U4.13), SS_24 (SW18.25 SW18.26)
RV3_3: Main_circuit (U4.14), SS_24 (SW19.25 SW19.26)
RV3_4: Main_circuit (U4.15), SS_24 (SW20.25 SW20.26)
RV3_5: Main_circuit (U4.1), SS_24 (SW21.25 SW21.26)
RV3_6: Main_circuit (U4.2), SS_24 (SW22.25 SW22.26)
RV3_7: Main_circuit (U4.4), SS_24 (SW23.25 SW23.26)
RV3_8: Main_circuit (U4.5), SS_24 (SW24.25 SW24.26)